# EAGLE design ENTRENADOR16F1939 (EAGLE 9.6.2)
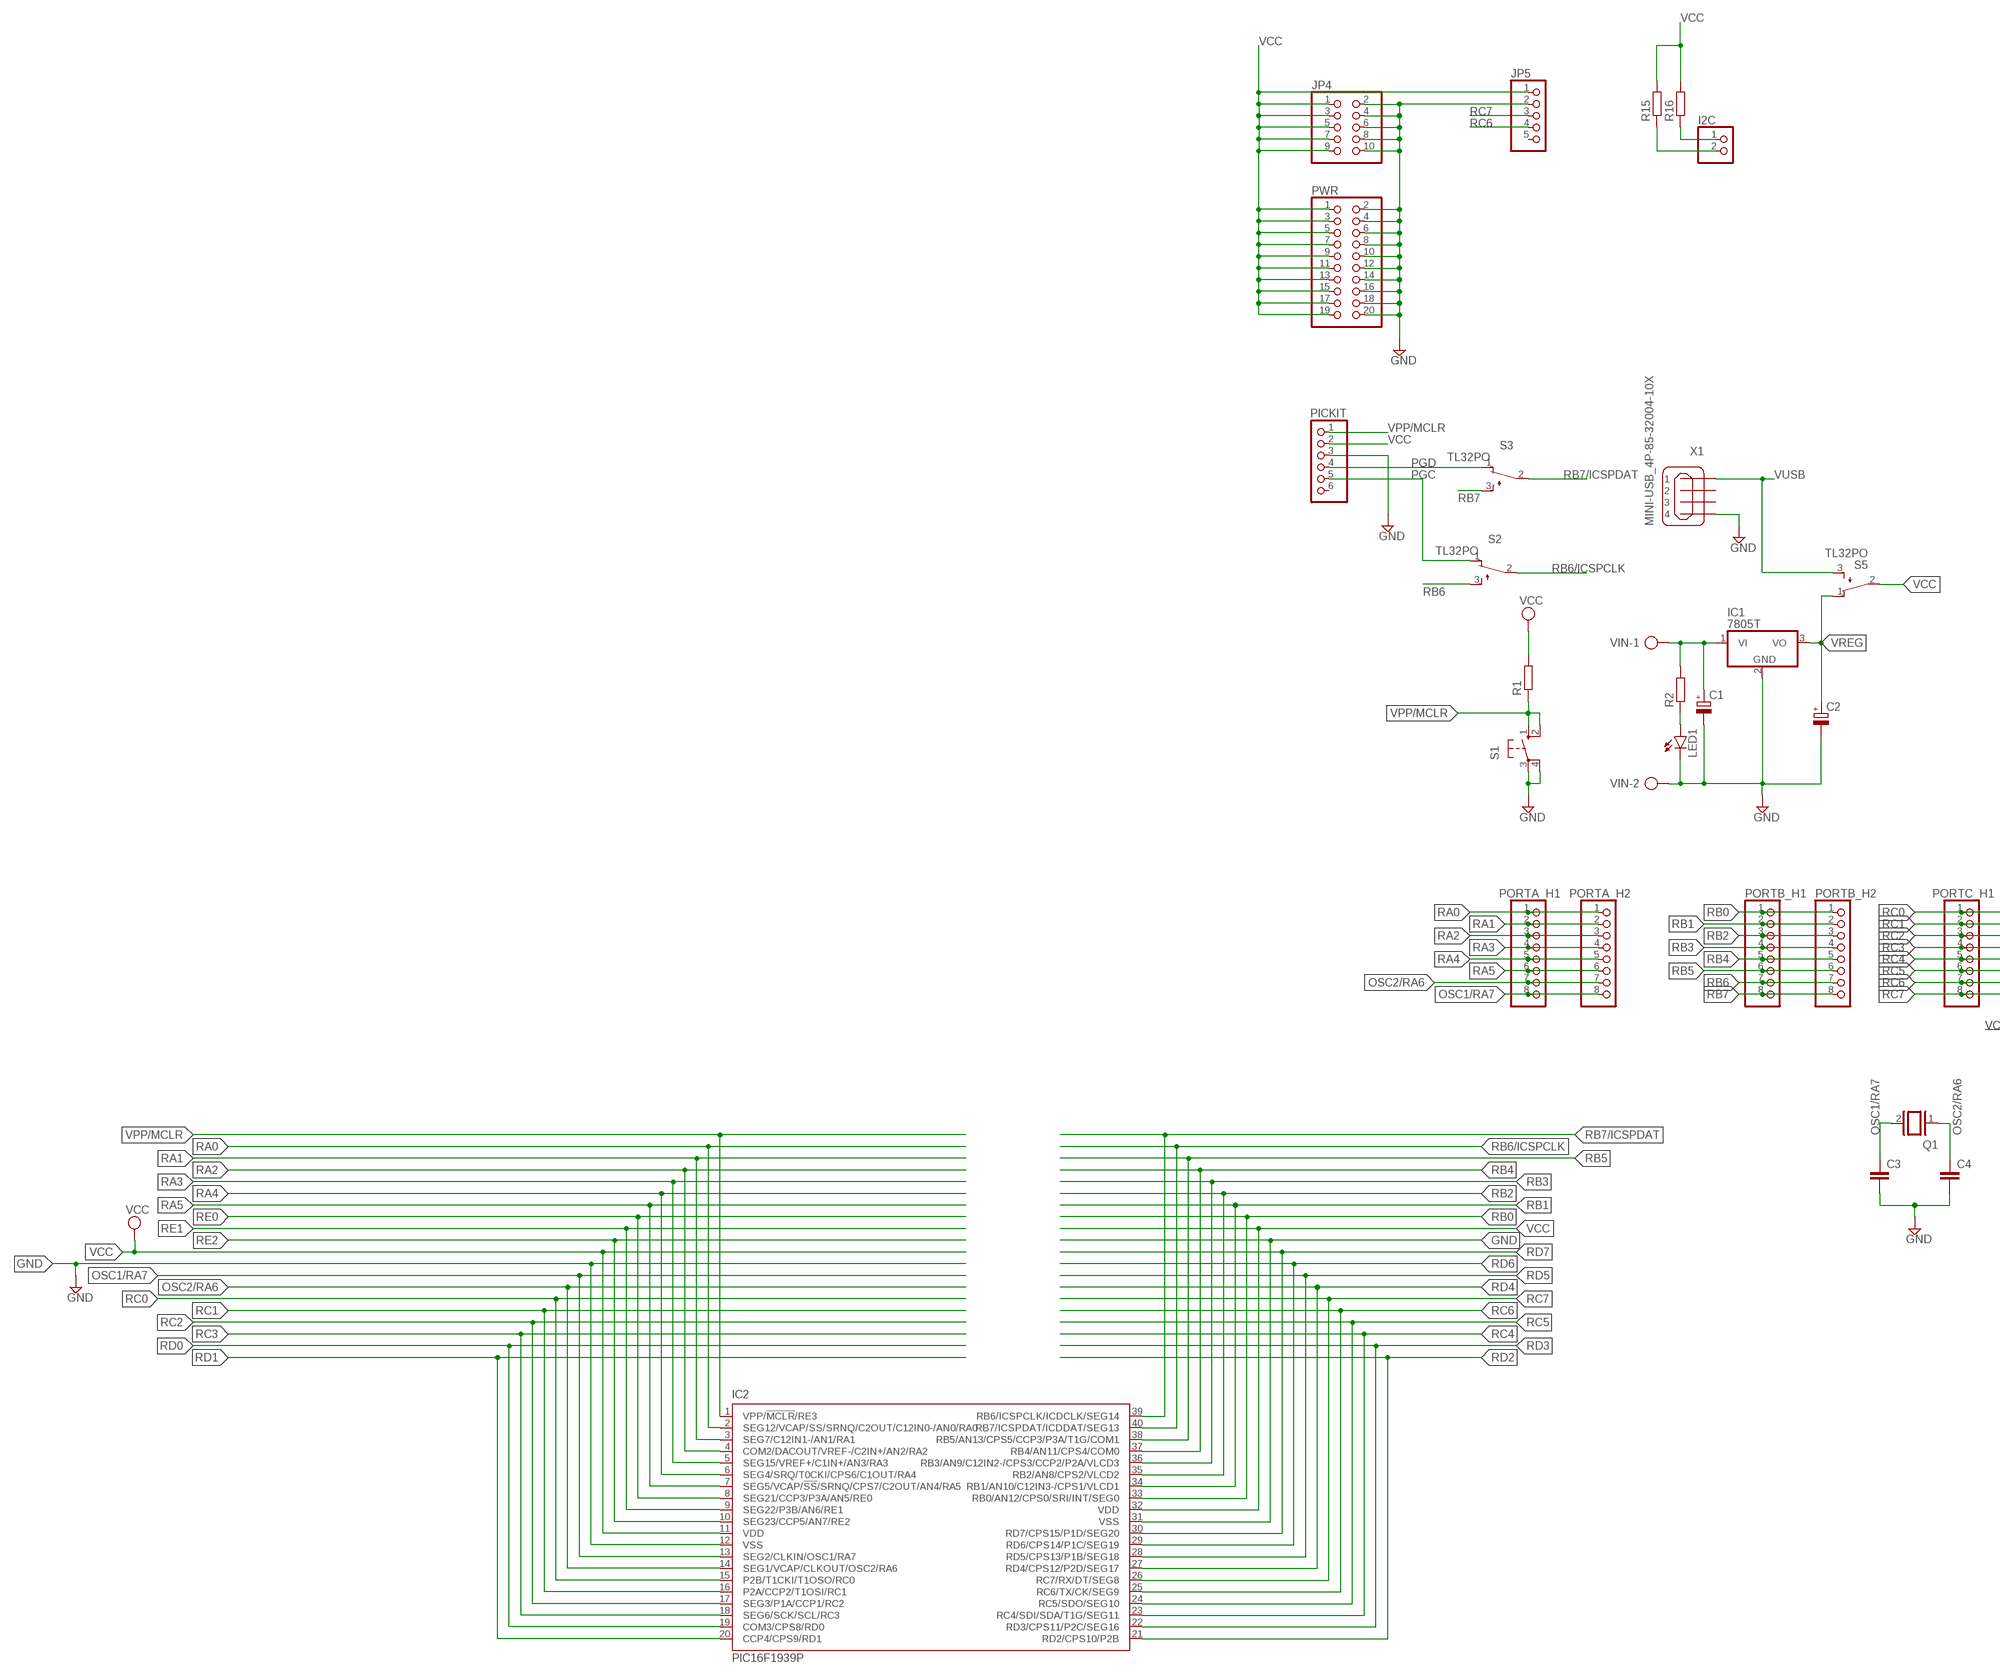
[diagram p0: schematic, sheet 1, part 1 of 2]
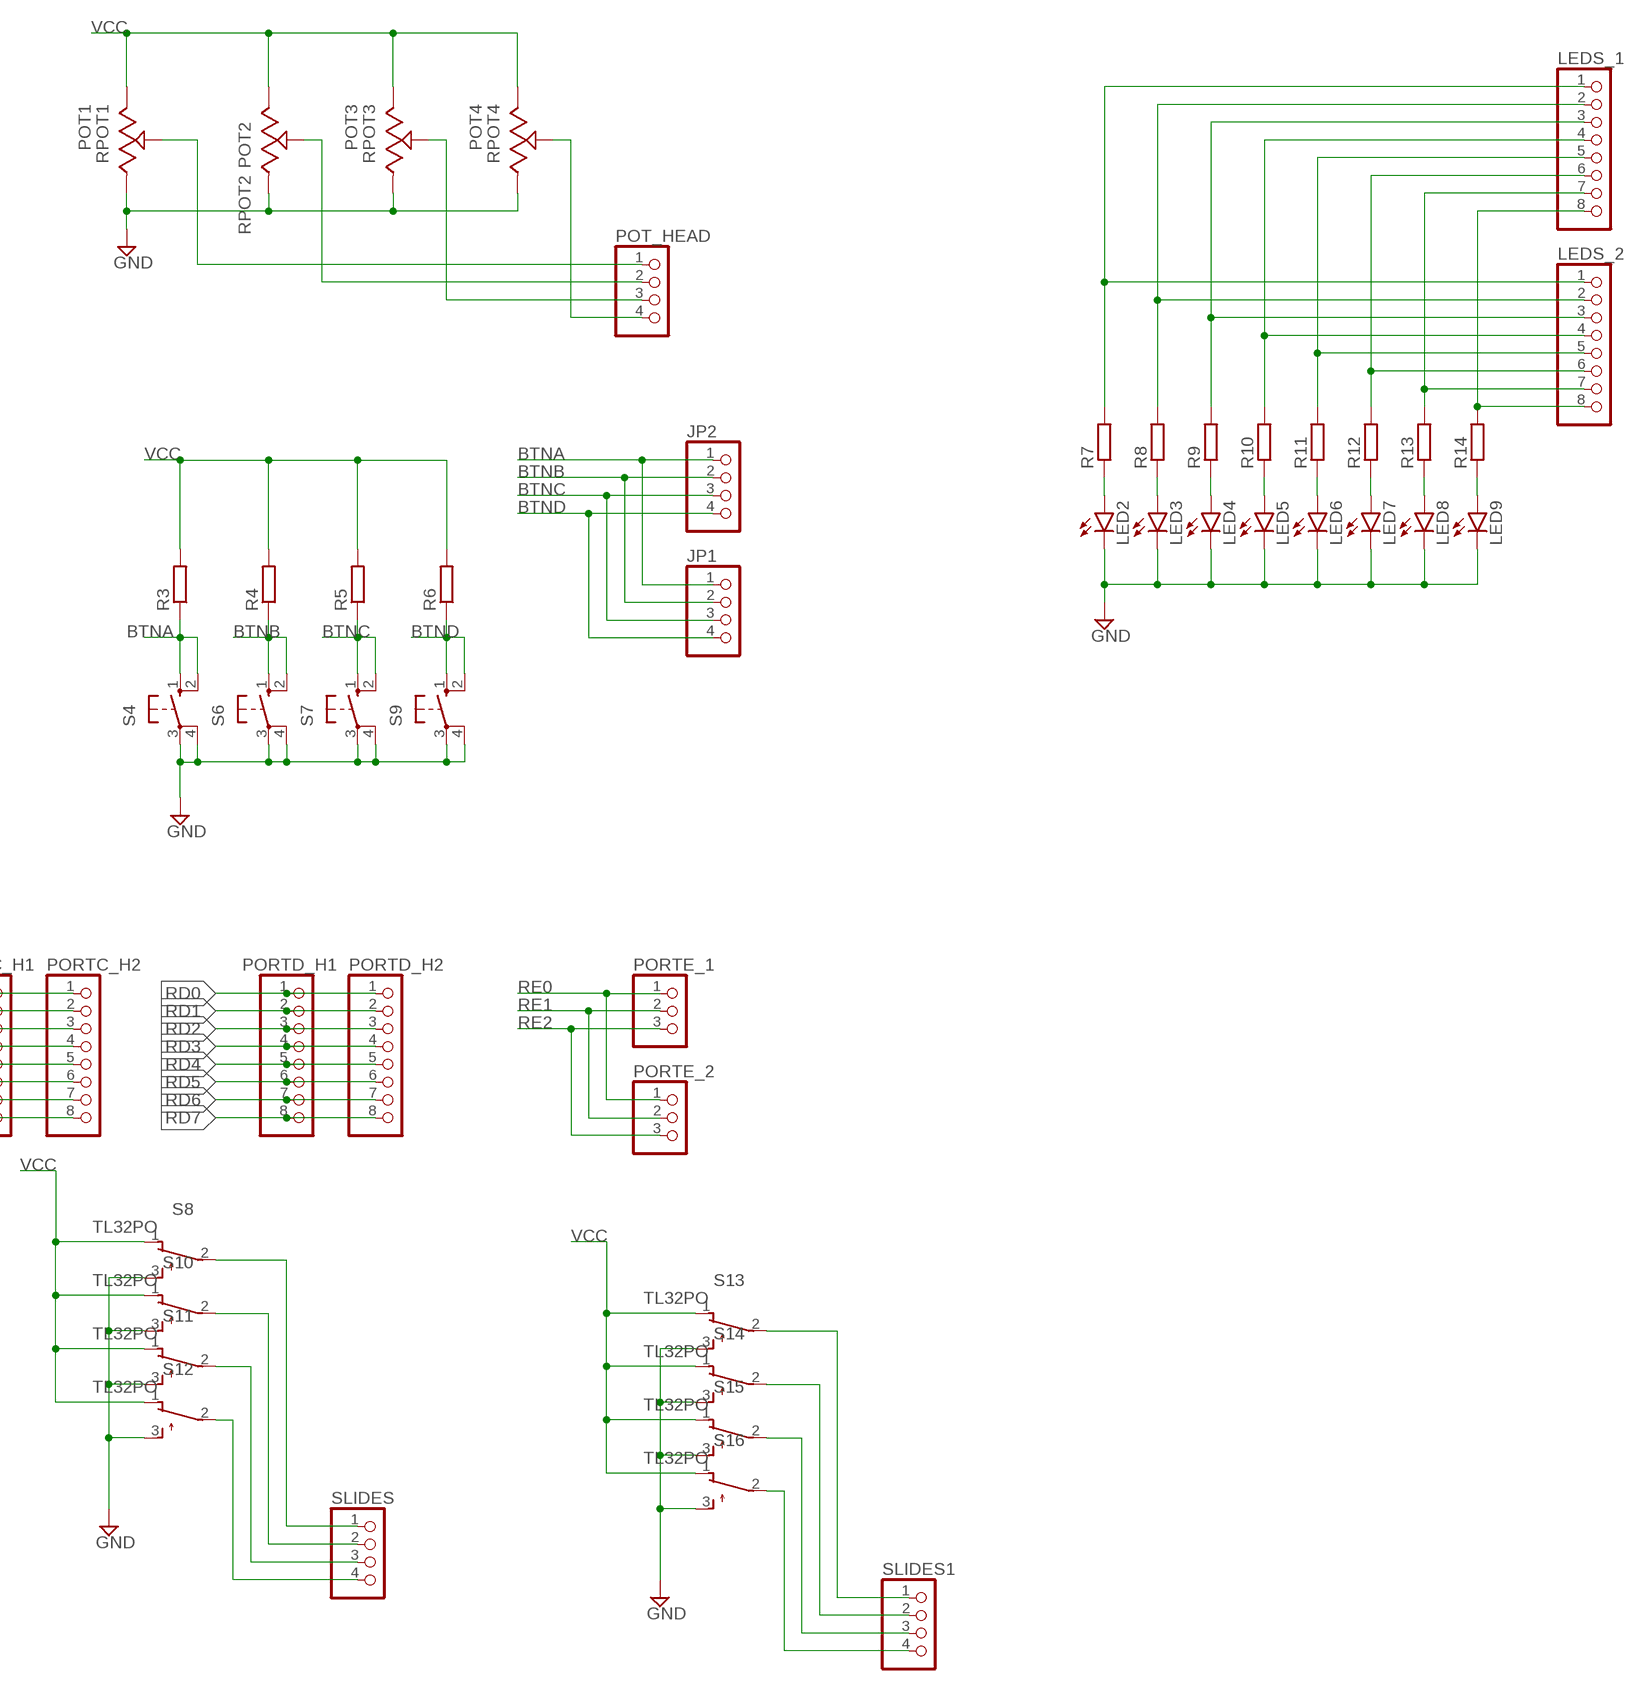
[diagram p1: schematic, sheet 1, part 2 of 2]

## Parts
C1  CPOL-EUE2.5-6  [E2,5-6]
C2  CPOL-EUE2.5-6  [E2,5-6]
C3  C-EU025-024X044  [C025-024X044]
C4  C-EU025-024X044  [C025-024X044]
I2C  PINHD-1X2  [1X02]
IC1  7805T  [TO220H]
IC2  PIC16F1939P  [DIL40]
JP1  PINHD-1X4  [1X04]
JP2  PINHD-1X4  [1X04]
JP4  PINHD-2X5  [2X05]
JP5  PINHD-1X5  [1X05]
LED1  LED3MM  [LED3MM]
LED2  LED3MM  [LED3MM]
LED3  LED3MM  [LED3MM]
LED4  LED3MM  [LED3MM]
LED5  LED3MM  [LED3MM]
LED6  LED3MM  [LED3MM]
LED7  LED3MM  [LED3MM]
LED8  LED3MM  [LED3MM]
LED9  LED3MM  [LED3MM]
LEDS_1  PINHD-1X8  [1X08]
LEDS_2  PINHD-1X8  [1X08]
PICKIT  PINHD-1X6  [1X06]
PORTA_H1  PINHD-1X8  [1X08]
PORTA_H2  PINHD-1X8  [1X08]
PORTB_H1  PINHD-1X8  [1X08]
PORTB_H2  PINHD-1X8  [1X08]
PORTC_H1  PINHD-1X8  [1X08]
PORTC_H2  PINHD-1X8  [1X08]
PORTD_H1  PINHD-1X8  [1X08]
PORTD_H2  PINHD-1X8  [1X08]
PORTE_1  PINHD-1X3  [1X03]
PORTE_2  PINHD-1X3  [1X03]
POT1  RPOT1  3386P-1-101TLF  [TRIM_3386P-1-101TLF]
POT2  RPOT2  3386P-1-101TLF  [TRIM_3386P-1-101TLF]
POT3  RPOT3  3386P-1-101TLF  [TRIM_3386P-1-101TLF]
POT4  RPOT4  3386P-1-101TLF  [TRIM_3386P-1-101TLF]
POT_HEAD  PINHD-1X4  [1X04]
PWR  PINHD-2X10  [2X10]
Q1  XTAL/S  [QS]
R1  R-EU_0204/7  [0204/7]
R2  R-EU_0204/7  [0204/7]
R3  R-EU_0204/7  [0204/7]
R4  R-EU_0204/7  [0204/7]
R5  R-EU_0204/7  [0204/7]
R6  R-EU_0204/7  [0204/7]
R7  R-EU_0204/7  [0204/7]
R8  R-EU_0204/7  [0204/7]
R9  R-EU_0204/7  [0204/7]
R10  R-EU_0204/7  [0204/7]
R11  R-EU_0204/7  [0204/7]
R12  R-EU_0204/7  [0204/7]
R13  R-EU_0204/7  [0204/7]
R14  R-EU_0204/7  [0204/7]
R15  R-EU_0204/7  [0204/7]
R16  R-EU_0204/7  [0204/7]
S1  10-XX  [B3F-10XX]
S2  TL32PO  [TL3XPO]
S3  TL32PO  [TL3XPO]
S4  10-XX  [B3F-10XX]
S5  TL32PO  [TL3XPO]
S6  10-XX  [B3F-10XX]
S7  10-XX  [B3F-10XX]
S8  TL32PO  [TL3XPO]
S9  10-XX  [B3F-10XX]
S10  TL32PO  [TL3XPO]
S11  TL32PO  [TL3XPO]
S12  TL32PO  [TL3XPO]
S13  TL32PO  [TL3XPO]
S14  TL32PO  [TL3XPO]
S15  TL32PO  [TL3XPO]
S16  TL32PO  [TL3XPO]
SLIDES  PINHD-1X4  [1X04]
SLIDES1  PINHD-1X4  [1X04]
VIN  AK300/2  [AK300/2]
X1  MINI-USB_4P-85-32004-10X  [85-32004-10X]

## Nets
BTNA: JP1.1 JP2.1 R3.1 S4.1(S) S4.2(S1)
BTNB: JP1.2 JP2.2 R4.1 S6.1(S) S6.2(S1)
BTNC: JP1.3 JP2.3 R5.1 S7.1(S) S7.2(S1)
BTND: JP1.4 JP2.4 R6.1 S9.1(S) S9.2(S1)
GND: C1.- C2.- C3.2 C4.2 IC1.2(GND) IC2.12(VSS) IC2.31(VSS) JP4.2 JP4.4 JP4.6 JP4.8 JP4.10 JP5.2 LED1.K(C) LED2.K(C) LED3.K(C) LED4.K(C) LED5.K(C) LED6.K(C) LED7.K(C) LED8.K(C) LED9.K(C) PICKIT.3 POT1.3(CW) POT2.3(CW) POT3.3(CW) POT4.3(CW) PWR.2 PWR.4 PWR.6 PWR.8 PWR.10 PWR.12 PWR.14 PWR.16 PWR.18 PWR.20 S1.3(P) S1.4(P1) S4.3(P) S4.4(P1) S6.3(P) S6.4(P1) S7.3(P) S7.4(P1) S8.3(S) S9.3(P) S9.4(P1) S10.3(S) S11.3(S) S12.3(S) S13.3(S) S14.3(S) S15.3(S) S16.3(S) VIN.2 X1.4
N$1: C1.+ IC1.1(VI) R2.2 VIN.1
N$2: LED2.A R7.1
N$3: LED1.A R2.1
N$4: LED3.A R8.1
N$5: LED4.A R9.1
N$6: LED5.A R10.1
N$7: LED6.A R11.1
N$8: LED7.A R12.1
N$9: LED8.A R13.1
N$10: LED9.A R14.1
N$11: LEDS_1.8 LEDS_2.8 R14.2
N$12: LEDS_1.7 LEDS_2.7 R13.2
N$13: LEDS_1.6 LEDS_2.6 R12.2
N$14: LEDS_1.5 LEDS_2.5 R11.2
N$15: LEDS_1.4 LEDS_2.4 R10.2
N$16: LEDS_1.3 LEDS_2.3 R9.2
N$17: LEDS_1.2 LEDS_2.2 R8.2
N$18: LEDS_1.1 LEDS_2.1 R7.2
N$19: S12.2(P) SLIDES.4
N$20: S8.2(P) SLIDES.1
N$21: S10.2(P) SLIDES.2
N$22: S11.2(P) SLIDES.3
N$23: POT1.2(WIPER) POT_HEAD.1
N$24: POT2.2(WIPER) POT_HEAD.2
N$25: POT3.2(WIPER) POT_HEAD.3
N$26: POT4.2(WIPER) POT_HEAD.4
N$27: I2C.2 R15.1
N$28: I2C.1 R16.1
N$29: S13.2(P) SLIDES1.1
N$30: S14.2(P) SLIDES1.2
N$31: S15.2(P) SLIDES1.3
N$32: S16.2(P) SLIDES1.4
OSC1/RA7: C3.1 IC2.13(SEG2/CLKIN/OSC1/RA7) PORTA_H1.8 PORTA_H2.8 Q1.2
OSC2/RA6: C4.1 IC2.14(SEG1/VCAP/CLKOUT/OSC2/RA6) PORTA_H1.7 PORTA_H2.7 Q1.1
PGC: PICKIT.5 S2.1(O)
PGD: PICKIT.4 S3.1(O)
RA0: IC2.2(SEG12/VCAP/SS/SRNQ/C2OUT/C12IN0-/AN0/RA0) PORTA_H1.1 PORTA_H2.1
RA1: IC2.3(SEG7/C12IN1-/AN1/RA1) PORTA_H1.2 PORTA_H2.2
RA2: IC2.4(COM2/DACOUT/VREF-/C2IN+/AN2/RA2) PORTA_H1.3 PORTA_H2.3
RA3: IC2.5(SEG15/VREF+/C1IN+/AN3/RA3) PORTA_H1.4 PORTA_H2.4
RA4: IC2.6(SEG4/SRQ/T0CKI/CPS6/C1OUT/RA4) PORTA_H1.5 PORTA_H2.5
RA5: IC2.7(SEG5/VCAP/!SS!/SRNQ/CPS7/C2OUT/AN4/RA5) PORTA_H1.6 PORTA_H2.6
RB0: IC2.33(RB0/AN12/CPS0/SRI/INT/SEG0) PORTB_H1.1 PORTB_H2.1
RB1: IC2.34(RB1/AN10/C12IN3-/CPS1/VLCD1) PORTB_H1.2 PORTB_H2.2
RB2: IC2.35(RB2/AN8/CPS2/VLCD2) PORTB_H1.3 PORTB_H2.3
RB3: IC2.36(RB3/AN9/C12IN2-/CPS3/CCP2/P2A/VLCD3) PORTB_H1.4 PORTB_H2.4
RB4: IC2.37(RB4/AN11/CPS4/COM0) PORTB_H1.5 PORTB_H2.5
RB5: IC2.38(RB5/AN13/CPS5/CCP3/P3A/T1G/COM1) PORTB_H1.6 PORTB_H2.6
RB6: PORTB_H1.7 PORTB_H2.7 S2.3(S)
RB6/ICSPCLK: IC2.40(RB7/ICSPDAT/ICDDAT/SEG13) S2.2(P)
RB7: PORTB_H1.8 PORTB_H2.8 S3.3(S)
RB7/ICSPDAT: IC2.39(RB6/ICSPCLK/ICDCLK/SEG14) S3.2(P)
RC0: IC2.15(P2B/T1CKI/T1OSO/RC0) PORTC_H1.1 PORTC_H2.1
RC1: IC2.16(P2A/CCP2/T1OSI/RC1) PORTC_H1.2 PORTC_H2.2
RC2: IC2.17(SEG3/P1A/CCP1/RC2) PORTC_H1.3 PORTC_H2.3
RC3: IC2.18(SEG6/SCK/SCL/RC3) PORTC_H1.4 PORTC_H2.4
RC4: IC2.23(RC4/SDI/SDA/T1G/SEG11) PORTC_H1.5 PORTC_H2.5
RC5: IC2.24(RC5/SDO/SEG10) PORTC_H1.6 PORTC_H2.6
RC6: IC2.25(RC6/TX/CK/SEG9) JP5.4 PORTC_H1.7 PORTC_H2.7
RC7: IC2.26(RC7/RX/DT/SEG8) JP5.3 PORTC_H1.8 PORTC_H2.8
RD0: IC2.19(COM3/CPS8/RD0) PORTD_H1.1 PORTD_H2.1
RD1: IC2.20(CCP4/CPS9/RD1) PORTD_H1.2 PORTD_H2.2
RD2: IC2.21(RD2/CPS10/P2B) PORTD_H1.3 PORTD_H2.3
RD3: IC2.22(RD3/CPS11/P2C/SEG16) PORTD_H1.4 PORTD_H2.4
RD4: IC2.27(RD4/CPS12/P2D/SEG17) PORTD_H1.5 PORTD_H2.5
RD5: IC2.28(RD5/CPS13/P1B/SEG18) PORTD_H1.6 PORTD_H2.6
RD6: IC2.29(RD6/CPS14/P1C/SEG19) PORTD_H1.7 PORTD_H2.7
RD7: IC2.30(RD7/CPS15/P1D/SEG20) PORTD_H1.8 PORTD_H2.8
RE0: IC2.8(SEG21/CCP3/P3A/AN5/RE0) PORTE_1.1 PORTE_2.1
RE1: IC2.9(SEG22/P3B/AN6/RE1) PORTE_1.2 PORTE_2.2
RE2: IC2.10(SEG23/CCP5/AN7/RE2) PORTE_1.3 PORTE_2.3
VCC: IC2.11(VDD) IC2.32(VDD) JP4.1 JP4.3 JP4.5 JP4.7 JP4.9 JP5.1 PICKIT.2 POT1.1(CCW) POT2.1(CCW) POT3.1(CCW) POT4.1(CCW) PWR.1 PWR.3 PWR.5 PWR.7 PWR.9 PWR.11 PWR.13 PWR.15 PWR.17 PWR.19 R1.2 R3.2 R4.2 R5.2 R6.2 R15.2 R16.2 S5.2(P) S8.1(O) S10.1(O) S11.1(O) S12.1(O) S13.1(O) S14.1(O) S15.1(O) S16.1(O)
VPP/MCLR: IC2.1(VPP/!MCLR!/RE3) PICKIT.1 R1.1 S1.1(S) S1.2(S1)
VREG: C2.+ IC1.3(VO) S5.1(O)
VUSB: S5.3(S) X1.1
Unconnected: JP5.5 PICKIT.6 X1.2 X1.3

## Library data of the parts
C1 C2 = rcl:CPOL-EU: POLARIZED CAPACITOR, European symbol; SPICEPREFIX: C
C3 C4 = rcl:C-EU: CAPACITOR, European symbol; SPICEPREFIX: C
I2C = pinhead:PINHD-1X2: PIN HEADER
IC1 = linear:78*: Positive VOLTAGE REGULATOR Source: http://cache.national.com/ds/LM/LM78L05.pdf http://www.fairchildsemi.com/ds/LM/LM7805.pdf
IC2 = microchip:PIC16F193*?: Flash-Based, 8-Bit CMOS Microcontrollers wtih LCD Driver and nanoWatt XLP Technology Auto generated by make-symbol-device-package-bsdl.ulp Rev. 33 Source: http://ww1.microchip.com/downloads/en/DeviceDoc/41364D.pdf; MPN: PIC16F1939-I/P; OC_FARNELL: 1755832; OC_NEWARK: 08R1958
JP1 JP2 POT_HEAD SLIDES SLIDES1 = pinhead:PINHD-1X4: PIN HEADER
JP4 = pinhead:PINHD-2X5: PIN HEADER
JP5 = pinhead:PINHD-1X5: PIN HEADER
LED1-LED9 = led:LED: LED OSRAM: - CHIPLED LG R971, LG N971, LY N971, LG Q971, LY Q971, LO R971, LY R971 LH N974, LH R974 LS Q976, LO Q976, LY Q976 LO Q996 - Hyper CHIPLED LW Q18S LB Q993, LB Q99A, LB R99A - SideLED LS A670, LO A670, LY A670, LG A670, LP A670 LB A673, LV A673, LT A673, LW A673 LH A674 LY A675 LS A676, LA A676, LO A676, LY A676, LW A676 LS A679, LY A679, LG A679 - Hyper Micro SIDELED® LS Y876, LA Y876, LO Y876, LY Y876 LT Y87S - SmartLED LW L88C, LW L88S LB L89C, LB L89S, LG L890 LS L89K, LO L89K, LY L89K LS L896, LA L896, LO L896, LY L896 - TOPLED LS T670, LO T670, LY T670, LG T670, LP T670 LSG T670, LSP T670, LSY T670, LOP T670, LYG T670 LG T671, LOG T671, LSG T671 LB T673, LV T673, LT T673, LW T673 LH T674 LS T676, LA T676, LO T676, LY T676, LB T676, LH T676, LSB T676, LW T676 LB T67C, LV T67C, LT T67C, LS T67K, LO T67K, LY T67K, LW E67C LS E67B, LA E67B, LO E67B, LY E67B, LB E67C, LV E67C, LT E67C LW T67C LS T679, LY T679, LG T679 LS T770, LO T770, LY T770, LG T770, LP T770 LB T773, LV T773, LT T773, LW T773 LH T774 LS E675, LA E675, LY E675, LS T675 LS T776, LA T776, LO T776, LY T776, LB T776 LHGB T686 LT T68C, LB T68C - Hyper Mini TOPLED® LB M676 - Mini TOPLED Santana® LG M470 LS M47K, LO M47K, LY M47K Source: http://www.osram.convergy.de LUXEON: - LUMILED® LXK2-PW12-R00, LXK2-PW12-S00, LXK2-PW14-U00, LXK2-PW14-V00 LXK2-PM12-R00, LXK2-PM12-S00, LXK2-PM14-U00 LXK2-PE12-Q00, LXK2-PE12-R00, LXK2-PE12-S00, LXK2-PE14-T00, LXK2-PE14-U00 LXK2-PB12-K00, LXK2-PB12-L00, LXK2-PB12-M00, LXK2-PB14-N00, LXK2-PB14-P00, LXK2-PB14-Q00 LXK2-PR12-L00, LXK2-PR12-M00, LXK2-PR14-Q00, LXK2-PR14-R00 LXK2-PD12-Q00, LXK2-PD12-R00, LXK2-PD12-S00 LXK2-PH12-R00, LXK2-PH12-S00 LXK2-PL12-P00, LXK2-PL12-Q00, LXK2-PL12-R00 Source: www.luxeon.com KINGBRIGHT: KA-3528ASYC Source: www.kingbright.com
LEDS_1 LEDS_2 PORTA_H1 PORTA_H2 PORTB_H1 PORTB_H2 PORTC_H1 PORTC_H2 PORTD_H1 PORTD_H2 = pinhead:PINHD-1X8: PIN HEADER
PICKIT = pinhead:PINHD-1X6: PIN HEADER
PORTE_1 PORTE_2 = pinhead:PINHD-1X3: PIN HEADER
POT1-POT4 = 3386P-1-101TLF:3386P-1-101TLF: Check availability <https://pricing.snapeda.com/parts/3386P-1-101TLF/Bourns/view-part?ref=eda>; AVAILABILITY: In Stock; DESCRIPTION: 100 Ohms 0.5W, 1/2W PC Pins Through Hole Trimmer Potentiometer Cermet 1.0 Turn Top Finger Adjustment; MF: Bourns; MP: 3386P-1-101TLF; PACKAGE: NON-STANDARD-3 Bourns; PRICE: None; PURCHASE-URL: https://pricing.snapeda.com/search?q=3386P-1-101TLF&ref=eda
PWR = pinhead:PINHD-2X10: PIN HEADER
Q1 = special:XTAL/S: CRYSTAL
R1-R16 = rcl:R-EU_: RESISTOR, European symbol; SPICEPREFIX: R
S1 S4 S6 S7 S9 = switch-omron:10-XX: OMRON SWITCH; MPN: B3F-1000; OC_FARNELL: 176432; OC_NEWARK: 36M3542
S2 S3 S5 S8 S10-S16 = switch:TL32PO: TINY SWITCH ON - MOM Source: http://www2.produktinfo.conrad.com/datenblaetter/700000-724999/705152-da-01-de-Subminiaturschalter_TL_36YO.pdf
VIN = con-ptr500:AK300/2: CONNECTOR; OC_FARNELL: unknown; OC_NEWARK: unknown
X1 = con-cypressindustries:MINI-USB_4P-: MINI USB 4 Pol. Source: www.cypressindustries.com; OC_FARNELL: unknown; OC_NEWARK: unknown; SPICEPREFIX: X

## Board
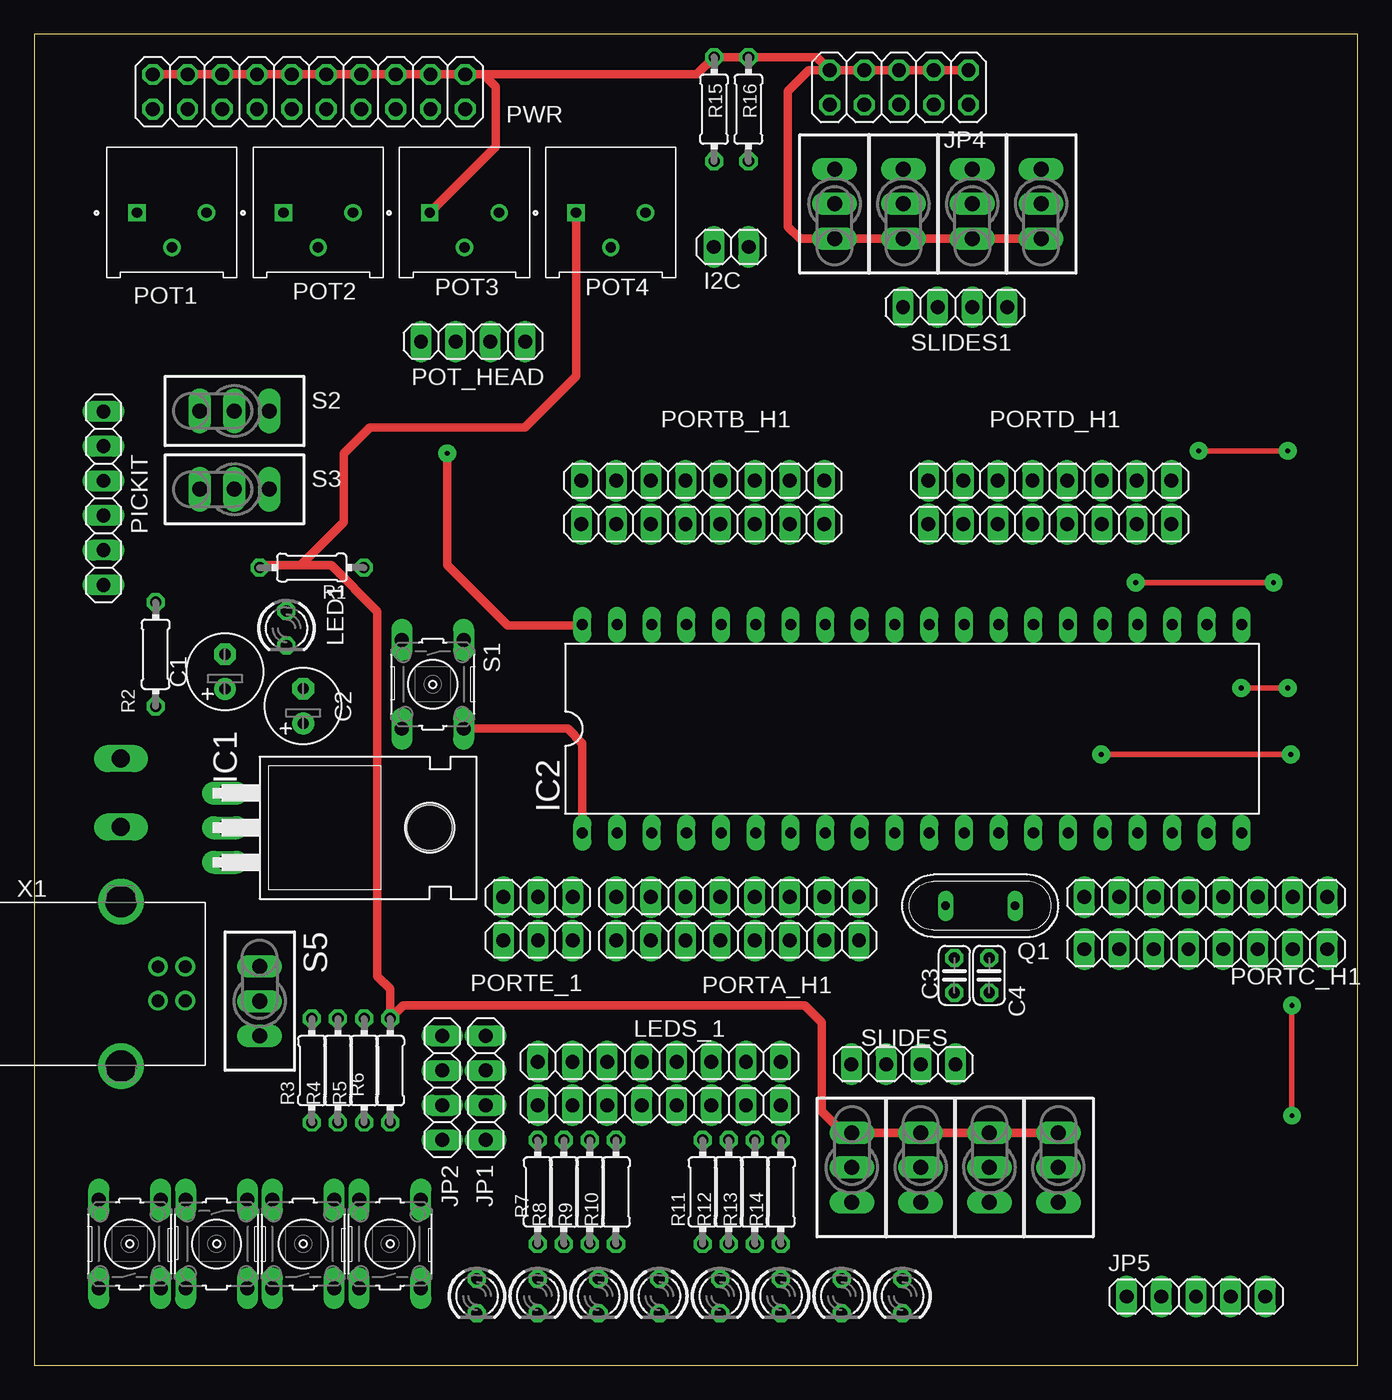
[diagram p2: board, top side]
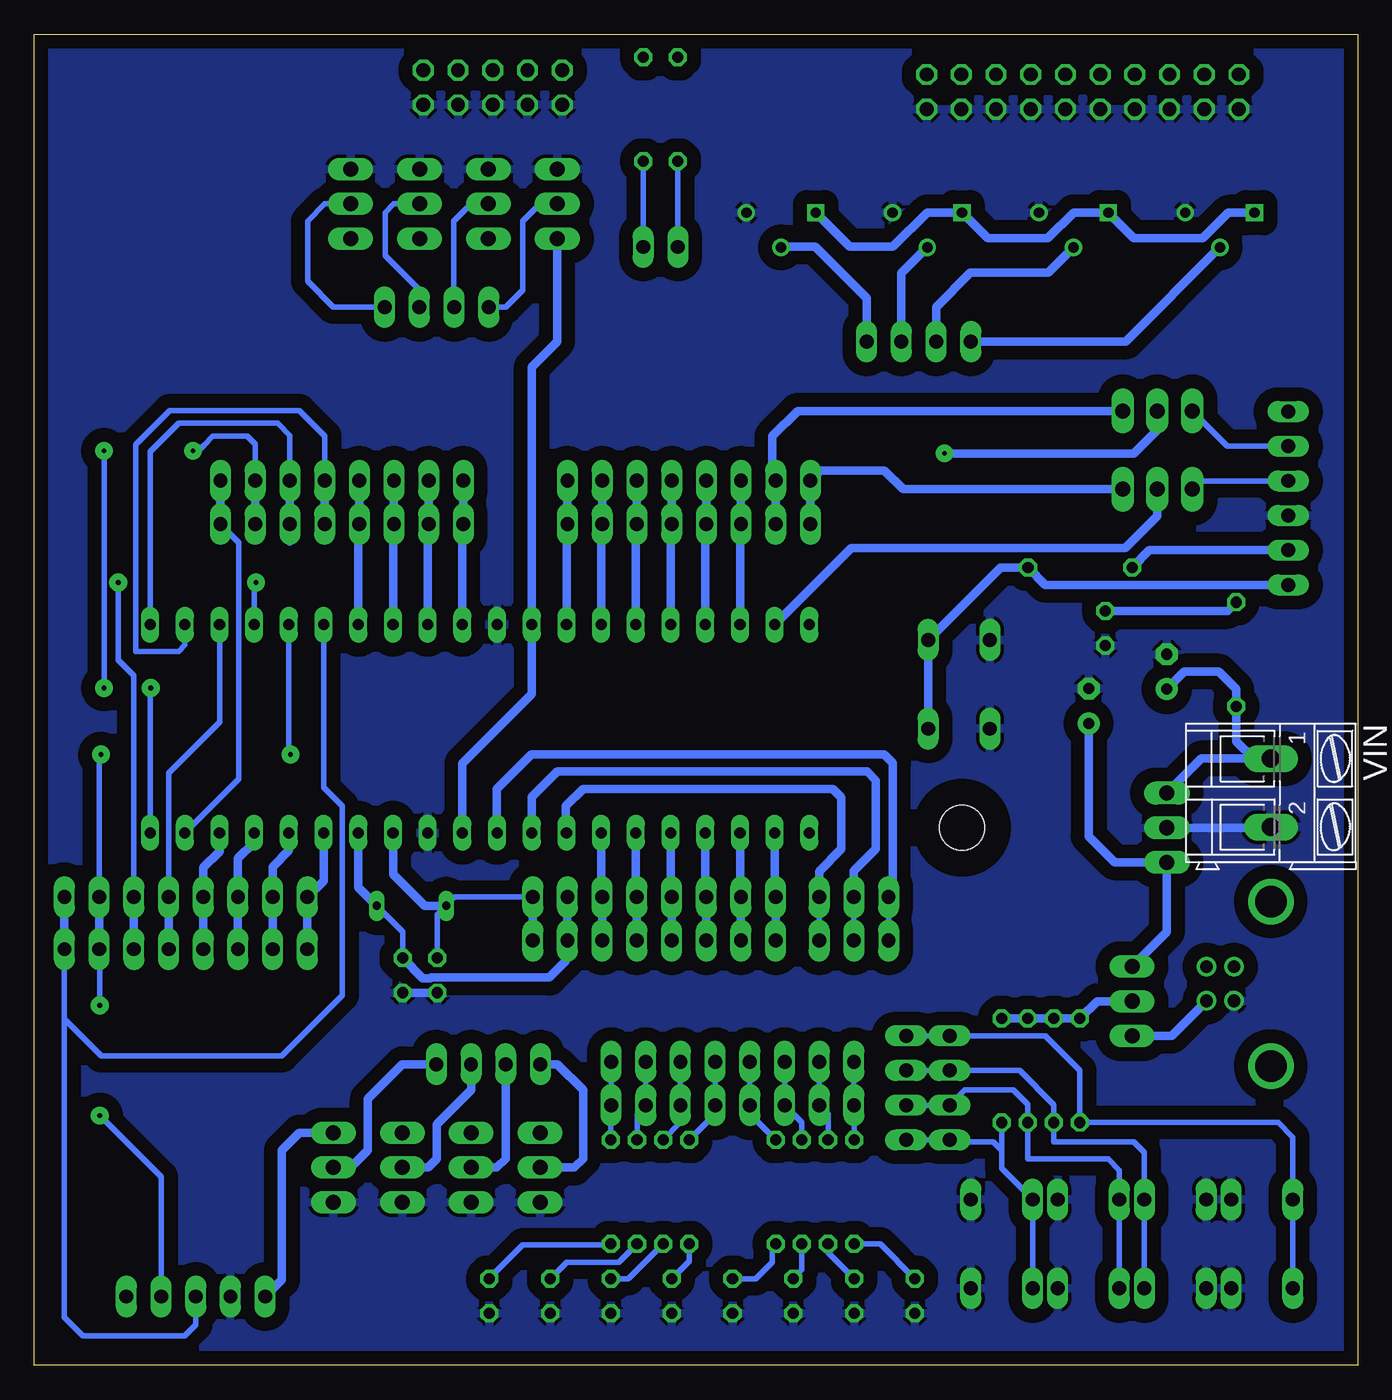
[diagram p3: board, bottom side, seen from below]

Size 96.88 x 97.48 mm. Coordinates in mm from the lower left corner, seen from the top.
Outline: 0,0 96.88,0 96.88,97.48 0,97.48 0,0
Copper layers (1*16): Top 0.035mm / dielectric 1.5mm / Bottom 0.035mm
Design rules "default": minimum track width 6mil, minimum drill 0.35mm, track to track 6mil, track to pad 6mil, pad to pad 6mil, via to via 6mil, smd to smd 6mil, copper to edge 40mil, drill to drill 6mil, minimum pad ring 10mil, minimum via ring 8mil, stop-mask expansion 4mil, vias tented up to drill 0mil, thermal gap 10mil

### Footprints (pad centres in the part's own frame; a part is rotated, then mirrored left to right if it is on the bottom)
E2,5-6 = drill 0.813 pad 1.6: + -1.27,0 | drill 0.813 pad 1.6 octagon: - 1.27,0
C025-024X044 = drill 0.813 octagon: 1 -1.27,0; 2 1.27,0
1X02 = drill 1.016 long: 1 -1.27,0; 2 1.27,0
TO220H = drill 1.118 long: 1 -2.54,-10.16; 2 0,-10.16; 3 2.54,-10.16 | hole 3.302: 0,4.826
DIL40 = drill 0.813 long: 1 -24.13,-7.62; 2 -21.59,-7.62; 3 -19.05,-7.62; 4 -16.51,-7.62; 5 -13.97,-7.62; 6 -11.43,-7.62; 7 -8.89,-7.62; 8 -6.35,-7.62; 9 -3.81,-7.62; 10 -1.27,-7.62; 11 1.27,-7.62; 12 3.81,-7.62; 13 6.35,-7.62; 14 8.89,-7.62; 15 11.43,-7.62; 16 13.97,-7.62; 17 16.51,-7.62; 18 19.05,-7.62; 19 21.59,-7.62; 20 24.13,-7.62; 21 24.13,7.62; 22 21.59,7.62; 23 19.05,7.62; 24 16.51,7.62; 25 13.97,7.62; 26 11.43,7.62; 27 8.89,7.62; 28 6.35,7.62; 29 3.81,7.62; 30 1.27,7.62; 31 -1.27,7.62; 32 -3.81,7.62; 33 -6.35,7.62; 34 -8.89,7.62; 35 -11.43,7.62; 36 -13.97,7.62; 37 -16.51,7.62; 38 -19.05,7.62; 39 -21.59,7.62; 40 -24.13,7.62
1X04 = drill 1.016 long: 1 -3.81,0; 2 -1.27,0; 3 1.27,0; 4 3.81,0
2X05 = drill 1.016 octagon: 1 -5.08,-1.27; 2 -5.08,1.27; 3 -2.54,-1.27; 4 -2.54,1.27; 5 0,-1.27; 6 0,1.27; 7 2.54,-1.27; 8 2.54,1.27; 9 5.08,-1.27; 10 5.08,1.27
1X05 = drill 1.016 long: 1 -5.08,0; 2 -2.54,0; 3 0,0; 4 2.54,0; 5 5.08,0
LED3MM = drill 0.813 octagon: A -1.27,0; K 1.27,0
1X08 = drill 1.016 long: 1 -8.89,0; 2 -6.35,0; 3 -3.81,0; 4 -1.27,0; 5 1.27,0; 6 3.81,0; 7 6.35,0; 8 8.89,0
1X06 = drill 1.016 long: 1 -6.35,0; 2 -3.81,0; 3 -1.27,0; 4 1.27,0; 5 3.81,0; 6 6.35,0
1X03 = drill 1.016 long: 1 -2.54,0; 2 0,0; 3 2.54,0
TRIM_3386P-1-101TLF = drill 0.76 square: 1 -2.54,-0.015 | drill 0.76: 2 0,-2.555; 3 2.54,-0.015
2X10 = drill 1.016 octagon: 1 -11.43,-1.27; 2 -11.43,1.27; 3 -8.89,-1.27; 4 -8.89,1.27; 5 -6.35,-1.27; 6 -6.35,1.27; 7 -3.81,-1.27; 8 -3.81,1.27; 9 -1.27,-1.27; 10 -1.27,1.27; 11 1.27,-1.27; 12 1.27,1.27; 13 3.81,-1.27; 14 3.81,1.27; 15 6.35,-1.27; 16 6.35,1.27; 17 8.89,-1.27; 18 8.89,1.27; 19 11.43,-1.27; 20 11.43,1.27
QS = drill 0.61 long: 1 -2.54,0; 2 2.54,0
0204/7 = drill 0.813 octagon: 1 -3.81,0; 2 3.81,0
B3F-10XX = drill 1.016 long: 1 -3.251,2.261; 2 3.251,2.261; 3 -3.251,-2.261; 4 3.251,-2.261
TL3XPO = drill 1.1 pad 1.422 long: 1 -2.54,0; 2 0,0; 3 2.54,0
AK300/2 = drill 1.321 long: 1 -2.515,0; 2 2.489,0
85-32004-10X = drill 0.92 pad 1.27: 1 4.71,-1.25; 2 4.71,1.25; 3 2.71,1.25; 4 2.71,-1.25 | drill 2.3 pad 3: M1 0,6.02; M2 0,-6.02

### Placement (x,y rotation side)
C1  13.97,50.8 90 top
C2  19.69,48.28 90 top
C3  67.36,28.56 270 top
C4  69.9,28.56 270 top
I2C  51.03,81.9 180 top
IC1  24.13,39.37 270 top
IC2  64.26,46.62 0 top
JP1  33.05,20.32 270 top
JP2  29.87,20.32 270 top
JP4  63.31,93.57 180 top
JP5  85.05,5.04 0 top
LED1  18.47,53.98 270 top
LED2  32.41,5.08 270 top
LED3  36.86,5.08 270 top
LED4  41.31,5.08 270 top
LED5  45.76,5.08 270 top
LED6  50.21,5.08 270 top
LED7  54.66,5.08 270 top
LED8  59.11,5.08 270 top
LED9  63.56,5.08 270 top
LEDS_1  45.76,22.23 0 top
LEDS_2  45.76,19.05 0 top
PICKIT  5.08,63.5 90 top
PORTA_H1  51.49,34.29 0 top
PORTA_H2  51.49,31.11 0 top
PORTB_H1  48.95,61.6 180 top
PORTB_H2  48.95,64.78 180 top
PORTC_H1  85.77,34.29 0 top
PORTC_H2  85.77,30.48 0 top
PORTD_H1  74.35,61.6 180 top
PORTD_H2  74.35,64.78 180 top
PORTE_1  36.88,34.29 180 top
PORTE_2  36.88,31.11 180 top
POT1  10.08,84.42 0 top
POT2  20.79,84.42 0 top
POT3  31.5,84.42 0 top
POT4  42.21,84.42 0 top
POT_HEAD  32.13,74.97 0 top
PWR  20.12,93.26 180 top
Q1  69.26,33.65 180 top
R1  20.32,58.42 180 top
R2  8.89,52.07 270 top
R3  20.33,21.59 90 top
R4  22.24,21.59 90 top
R5  24.15,21.59 90 top
R6  26.06,21.59 90 top
R7  36.86,12.7 90 top
R8  38.77,12.7 90 top
R9  40.68,12.7 90 top
R10  42.59,12.7 90 top
R11  48.93,12.7 90 top
R12  50.84,12.7 90 top
R13  52.75,12.7 90 top
R14  54.66,12.7 90 top
R15  49.77,91.98 90 top
R16  52.29,91.98 90 top
S1  29.18,49.87 270 top
S2  14.66,69.89 0 top
S3  14.66,64.15 0 top
S4  7,8.89 90 top
S5  16.51,26.67 270 top
S6  13.35,8.89 270 top
S7  19.7,8.89 90 top
S8  74.97,14.49 270 top
S9  26.05,8.89 90 top
S10  69.93,14.49 270 top
S11  64.89,14.49 270 top
S12  59.85,14.49 270 top
S13  58.59,85.05 90 top
S14  63.63,85.05 90 top
S15  68.67,85.05 90 top
S16  73.71,85.05 90 top
SLIDES  63.63,22.05 180 top
SLIDES1  67.41,77.49 0 top
VIN  6.35,41.91 270 bottom
X1  6.35,27.94 0 top

### Tracks (layer width: path | path; a pad name or v marks a point on that pad's centre or on a via)
BTNA
  Bottom 0.406: S4.1 S4.2 4.74,16.71 5.81,17.78 R3.1 20.33,21.6 22.86,24.13 JP2.1 JP1.1
BTNB
  Bottom 0.406: JP1.2 JP2.2 24.74,21.59 22.24,19.09 R4.1 22.24,16.38 16.38,16.38 15.61,15.61 S6.1 S6.2
BTNC
  Bottom 0.406: S7.1 S7.2 17.44,14.29 18.27,15.12 24.15,15.12 R5.1 24.15,19.11 25.2,20.16 28.76,20.16 JP2.3 JP1.3
BTND
  Bottom 0.406: S9.1 S9.2 26.06,14.41 26.06,15.75 | JP1.4 JP2.4 29.74,16.38 26.69,16.38 26.06,15.75 | 26.06,15.75 R6.1
GND
  Bottom 0.61: IC1.2 6.4,39.37 VIN.2 | C3.2 C4.2
  pour Bottom (isolate 1.016): 0.63,97.48 0.63,0 96.58,0 96.58,97.48
N$1
  Bottom 0.61: VIN.1 7.62,44.42 | 7.62,44.42 11.46,44.42 IC1.1 | C1.+ 12.7,50.8 10.16,50.8 8.89,49.53 R2.2 8.89,45.7 7.62,44.42
N$2
  Bottom 0.406: LED2.A 34.95,8.89 R7.1
N$3
  Bottom 0.61: LED1.A 9.52,55.25 R2.1
N$4
  Bottom 0.406: LED3.A 38.77,8.26 R8.1
N$5
  Bottom 0.406: LED4.A 40.68,6.98 R9.1
N$6
  Bottom 0.406: R10.1 42.84,8.64 42.84,7.56 44.05,6.35 LED5.A
N$7
  Bottom 0.406: LED6.A 48.93,7.63 R11.1
N$8
  Bottom 0.406: R12.1 53.38,6.35 LED7.A
N$9
  Bottom 0.406: R13.1 54.08,7.56 57.9,7.56 LED8.A
N$10
  Bottom 0.406: R14.1 54.73,8.82 61.11,8.82 63.56,6.37 LED9.A
N$11
  Bottom 0.406: LEDS_1.8 LEDS_2.8 R14.2
N$12
  Bottom 0.406: LEDS_1.7 LEDS_2.7 52.75,18.41 R13.2
N$13
  Bottom 0.406: LEDS_1.6 LEDS_2.6 49.57,17.78 R12.2
N$14
  Bottom 0.406: LEDS_1.5 LEDS_2.5 47.03,18.41 R11.2
N$15
  Bottom 0.406: LEDS_1.4 LEDS_2.4 44.49,18.41 R10.2
N$16
  Bottom 0.406: LEDS_1.3 LEDS_2.3 40.68,17.78 R9.2
N$17
  Bottom 0.406: LEDS_1.2 LEDS_2.2 38.77,18.41 R8.2
N$18
  Bottom 0.406: LEDS_1.1 LEDS_2.1 R7.2
N$19
  Bottom 0.61: S12.2 57.33,14.49 56.7,15.12 56.7,20.16 58.59,22.05 SLIDES.4
N$20
  Bottom 0.61: S8.2 73.71,14.49 72.45,15.75 72.45,19.53 69.93,22.05 SLIDES.1
N$21
  Bottom 0.61: S10.2 68.04,14.49 67.41,15.12 67.41,17.64 64.89,20.16 SLIDES.2
N$22
  Bottom 0.61: S11.2 63,14.49 62.36,15.13 SLIDES.3
N$23
  Bottom 0.61: POT_HEAD.1 16.98,74.97 POT1.2
N$24
  Bottom 0.61: POT_HEAD.2 30.86,77.5 28.35,80.01 22.64,80.01 POT2.2
N$25
  Bottom 0.61: POT_HEAD.3 33.4,79.97 POT3.2
N$26
  Bottom 0.61: POT_HEAD.4 35.94,78.15 39.69,81.9 42.17,81.9 POT4.2
N$27
  Bottom 0.406: R15.1 I2C.2
N$28
  Bottom 0.406: R16.1 I2C.1
N$29
  Bottom 0.406: S13.2 59.85,85.05 61.11,83.79 61.11,78.75 62.37,77.49 SLIDES1.1
N$30
  Bottom 0.406: S14.2 64.89,85.05 66.15,83.79 SLIDES1.2
N$31
  Bottom 0.406: S15.2 70.56,85.05 71.19,84.42 71.19,81.27 68.68,78.76 SLIDES1.3
N$32
  Bottom 0.406: SLIDES1.4 74.97,77.49 76.86,79.38 76.86,83.79 75.6,85.05 S16.2
OSC1/RA7
  Bottom 0.406: C3.1 67.36,33.01 Q1.2 66.08,34.29 PORTA_H1.8
  Bottom 0.61: PORTA_H1.8 PORTA_H2.8 | Q1.2 68.3,33.65 70.61,35.96 IC2.13
OSC2/RA6
  Bottom 0.406: Q1.1 69.9,31.75 C4.1
  Bottom 0.61: PORTA_H1.7 PORTA_H2.7 57.96,30.99 57.96,29.61 59.16,28.41 67.82,28.41 67.88,28.35 68.42,28.35 C4.1 | Q1.1 73.15,35 IC2.14
PGC
  Bottom 0.406: PICKIT.5 9.54,67.31 S2.1
PGD
  Bottom 0.406: PICKIT.4 11.5,64.77 S3.1
RA0
  Bottom 0.61: PORTA_H2.1 PORTA_H1.1 42.67,34.36 IC2.2
RA1
  Bottom 0.61: PORTA_H2.2 PORTA_H1.2 45.21,34.36 IC2.3
RA2
  Bottom 0.61: PORTA_H2.3 PORTA_H1.3 47.75,34.36 IC2.4
RA3
  Bottom 0.61: PORTA_H2.4 PORTA_H1.4 50.29,34.36 IC2.5
RA4
  Bottom 0.61: PORTA_H2.5 PORTA_H1.5 52.83,34.36 IC2.6
RA5
  Bottom 0.61: PORTA_H2.6 PORTA_H1.6 55.37,34.36 IC2.7
RB0
  Bottom 0.61: PORTB_H2.1 PORTB_H1.1 57.91,61.53 IC2.33
RB1
  Bottom 0.61: PORTB_H2.2 PORTB_H1.2 55.37,61.53 IC2.34
RB2
  Bottom 0.61: PORTB_H2.3 PORTB_H1.3 52.83,61.53 IC2.35
RB3
  Bottom 0.61: PORTB_H2.4 PORTB_H1.4 50.29,61.53 IC2.36
RB4
  Bottom 0.61: PORTB_H2.5 PORTB_H1.5 47.75,61.53 IC2.37
RB5
  Bottom 0.61: PORTB_H2.6 PORTB_H1.6 45.21,61.53 IC2.38
RB6
  Bottom 0.61: PORTB_H1.7 PORTB_H2.7 42.84,65.02 42.84,68.04 40.99,69.89 S2.3
RB6/ICSPCLK  (via drill 0.35 pad 1.3)
  Top 0.61: v30.24,66.78 30.24,58.59 34.65,54.18 40.07,54.18 IC2.40
  Bottom 0.61: S2.2 14.66,68.5 16.38,66.78 v30.24,66.78
RB7
  Bottom 0.61: PORTB_H1.8 PORTB_H2.8 39.32,65.52 34.65,65.52 33.28,64.15 S3.3
RB7/ICSPDAT
  Bottom 0.61: S3.2 14.66,62.2 17.01,59.85 37.06,59.85 IC2.39
RC0
  Bottom 0.61: PORTC_H2.1 PORTC_H1.1 75.69,35.48 IC2.15
RC1
  Bottom 0.61: PORTC_H2.2 PORTC_H1.2 79.42,36.5 78.23,37.69 IC2.16
RC2
  Bottom 0.61: PORTC_H2.3 PORTC_H1.3 81.96,37.11 80.77,38.3 IC2.17
RC3
  Bottom 0.61: PORTC_H2.4 PORTC_H1.4 84.5,36.46 83.31,37.65 IC2.18
RC4
  Bottom 0.406: PORTC_H1.5 87.04,43.37 83.31,47.1 IC2.23
  Bottom 0.61: PORTC_H1.5 PORTC_H2.5
RC5  (via drill 0.35 pad 1.3)
  Top 0.406: v90.72,57.33 v80.64,57.33
  Bottom 0.305: 89.58,35.56 PORTC_H1.6
  Bottom 0.406: PORTC_H1.6 89.58,50.52 90.72,51.66 v90.72,57.33 | v80.64,57.33 80.77,57.2 IC2.24
  Bottom 0.61: PORTC_H1.6 PORTC_H2.6
RC6  (via drill 0.35 pad 1.3)
  Top 0.406: v78.12,44.73 v91.98,44.73 | v92.07,18.29 v92.07,26.35
  Bottom 0.406: IC2.25 78.23,44.84 v78.12,44.73 | v91.98,44.73 92.12,44.59 92.12,34.02 | JP5.4 87.59,13.81 v92.07,18.29 | PORTC_H2.7 92.07,30.43 v92.07,26.35
  Bottom 0.61: PORTC_H1.7 92.12,34.02 PORTC_H2.7
RC7
  Bottom 0.406: IC2.26 75.69,42.3 74.34,40.95 74.34,27.09 78.75,22.68 91.98,22.68 94.66,25.36 | 94.66,25.36 PORTC_H2.8 | JP5.3 85.05,2.99 85.87,2.17 93.31,2.17 94.66,3.52 94.66,25.36
  Bottom 0.61: PORTC_H1.8 PORTC_H2.8
RD0
  Bottom 0.406: IC2.19 81.9,42.95 81.9,60.26 PORTD_H1.1
  Bottom 0.61: PORTD_H2.1 PORTD_H1.1
RD1  (via drill 0.35 pad 1.3)
  Top 0.406: v88.35,49.6 v91.76,49.6 | v91.76,66.96 v85.25,66.96
  Bottom 0.406: PORTD_H2.2 80.7,67.47 81.27,68.04 83.79,68.04 84.44,67.39 84.74,67.09 84.87,66.96 v85.25,66.96 | IC2.20 88.39,49.56 v88.35,49.6 | v91.76,49.6 v91.76,66.96
  Bottom 0.61: PORTD_H2.2 PORTD_H1.2
RD2
  Bottom 0.406: IC2.21 88.39,66.91 86.31,68.99 79.06,68.99 78.16,68.09 PORTD_H2.3
  Bottom 0.61: PORTD_H2.3 PORTD_H1.3 78.16,60.33
RD3
  Bottom 0.406: IC2.22 85.85,52.75 86.31,52.29 89.46,52.29 89.46,67.41 86.94,69.93 77.49,69.93 75.6,68.04 75.6,64.8 PORTD_H2.4
  Bottom 0.61: PORTD_H2.4 PORTD_H1.4
RD4
  Bottom 0.61: PORTD_H2.5 PORTD_H1.5 73.15,61.53 IC2.27
RD5
  Bottom 0.61: PORTD_H2.6 PORTD_H1.6 70.61,61.53 IC2.28
RD6
  Bottom 0.61: PORTD_H2.7 PORTD_H1.7 68.07,61.53 IC2.29
RD7
  Bottom 0.61: PORTD_H2.8 PORTD_H1.8 65.53,61.53 IC2.30
RE0
  Bottom 0.406: PORTE_1.1 PORTE_2.1
  Bottom 0.61: PORTE_1.1 39.42,36.18 37.8,37.8 37.8,41.58 38.43,42.21 56.7,42.21 57.96,40.95 57.96,39.05 IC2.8
RE1
  Bottom 0.406: PORTE_1.2 PORTE_2.2
  Bottom 0.61: PORTE_1.2 36.88,36.2 35.28,37.8 35.28,42.84 35.91,43.47 58.59,43.47 60.45,41.61 IC2.9
RE2
  Bottom 0.406: PORTE_1.3 PORTE_2.3
  Bottom 0.61: PORTE_1.3 34.34,34.33 34.02,34.65 34.02,44.1 34.65,44.73 60.48,44.73 63,42.21 IC2.10
VCC
  Top 0.61: S8.1 S10.1 S11.1 S12.1 59.23,17.03 57.66,18.6 57.66,25.11 56.42,26.35 27.01,26.35 R6.2 26.06,27.57 25.13,28.5 25.13,55.2 21.74,58.59 19.53,58.59 | R1.2 16.68,58.59 19.53,58.59 | POT4.1 39.67,72.43 35.91,68.67 24.57,68.67 22.68,66.78 22.68,61.74 19.53,58.59 | PWR.19 PWR.17 PWR.15 PWR.13 PWR.11 PWR.9 PWR.7 PWR.5 PWR.3 PWR.1 | PWR.1 48.51,94.53 R15.2 R16.2 57.28,95.79 JP4.9 | JP4.9 JP4.7 JP4.5 JP4.3 JP4.1 | POT3.1 33.79,89.23 33.79,93.62 32.88,94.53 PWR.1 | JP4.9 56.71,94.84 55.18,93.31 55.18,83.39 56.06,82.51 S13.1 S14.1 S15.1 S16.1
  Bottom 0.61: PICKIT.2 15.24,59.69 R1.2 | S5.2 19.06,26.67 R3.2 R4.2 R5.2 R6.2 | IC2.11 65.53,44.09 60.45,49.17 IC2.32 60.45,73.11 58.59,74.97 S13.1 | POT1.1 9.46,84.41 11.34,82.53 16.38,82.53 POT2.1 18.27,84.42 20.79,84.42 22.68,82.53 27.09,82.53 POT3.1 28.98,84.42 31.5,84.42 34.02,81.9 37.17,81.9 POT4.1 | S8.1 77.47,17.03 78.75,15.75 78.75,6.26 JP5.1
VPP/MCLR
  Top 0.61: IC2.1 40.13,45.55 39.06,46.62 S1.2
  Bottom 0.61: S1.2 S1.1 26.14,58.42 R1.1 22.86,57.15 PICKIT.1
VREG
  Bottom 0.61: S5.1 13.97,31.75 IC1.3 17.78,36.83 19.69,38.74 C2.+
VUSB
  Bottom 0.61: X1.1 13.62,24.13 S5.3